# EAGLE design RS485_110V_PWM_V1 (EAGLE 6.3)
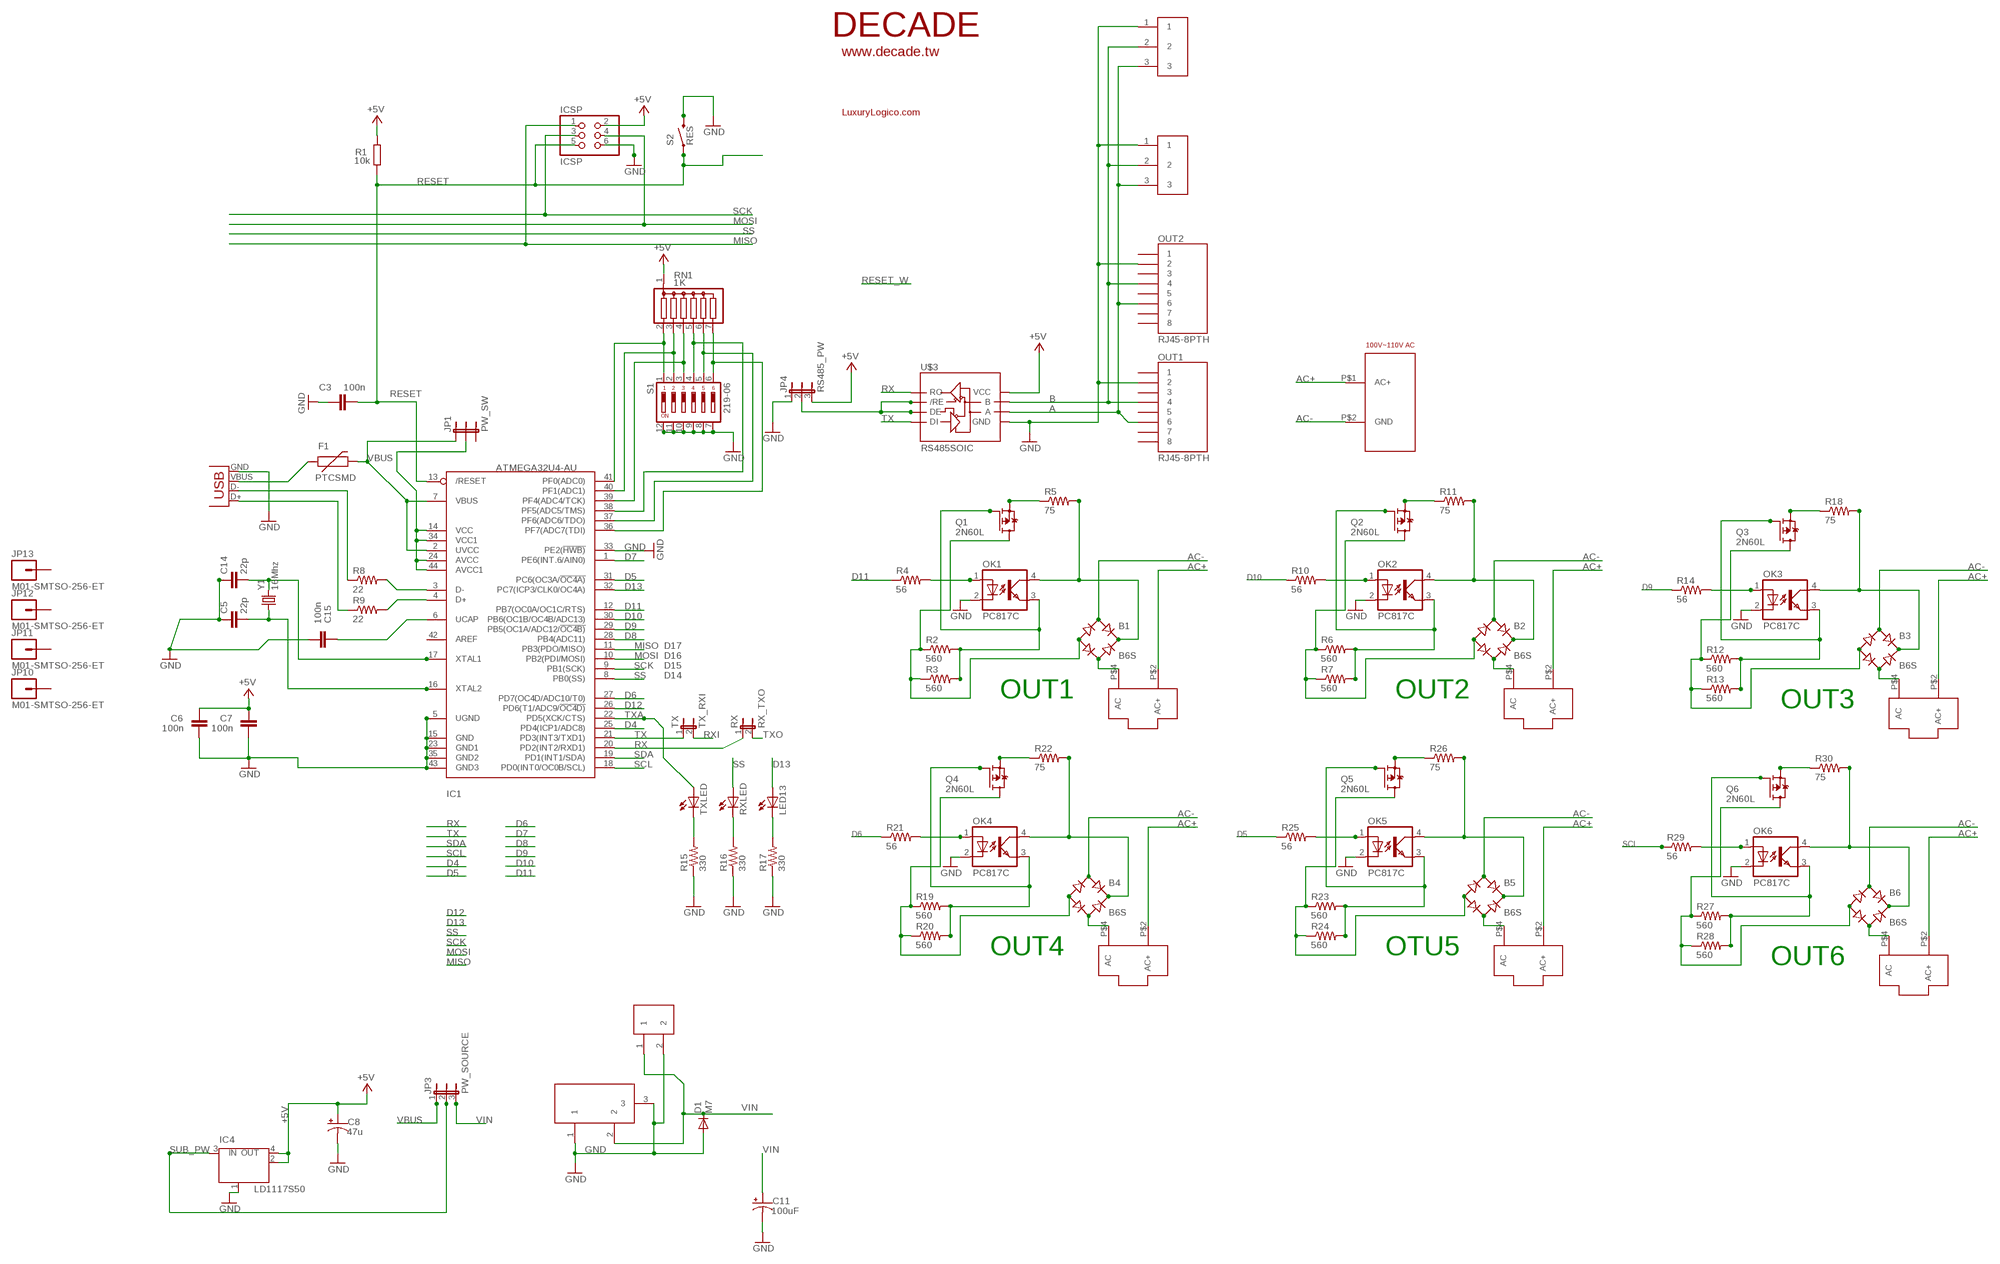
[diagram p0: schematic, sheet 1]

## Parts
B1  B6S  [MBS]
B2  B6S  [MBS]
B3  B6S  [MBS]
B4  B6S  [MBS]
B5  B6S  [MBS]
B6  B6S  [MBS]
C3  100n  C-EUC0603  [C0603-ROUND]
C5  22p  CAP0805  [0805]
C6  100n  C-EUC0603  [C0603-ROUND]
C7  100n  C-EUC0603  [C0603-ROUND]
C8  47u  CAP_POLE  [PANASONIC_E]
C11  100uF  CAP_POLE  [PANASONIC_E]
C14  22p  CAP0805  [0805]
C15  100n  C-EUC0603  [C0603-ROUND]
D1  M7  DIODE-SMB  [SMB]
F1  PTCSMD  [PTC-1206]
IC1  ATMEGA32U4-AU  [TQFP44]
IC4  LD1117S50  MC33269ST-3.3T3  [SOT223]
ICSP  ICSP  PINHD-2X3  [2X03]
JP1  PW_SW  JUMPER-3SMD  [SJ_3]
JP3  PW_SOURCE  JP2E  [JP2]
JP4  RS485_PW  JP2E  [JP2]
JP10  M01-SMTSO-256-ET  [SMTSO-256-ET]
JP11  M01-SMTSO-256-ET  [SMTSO-256-ET]
JP12  M01-SMTSO-256-ET  [SMTSO-256-ET]
JP13  M01-SMTSO-256-ET  [SMTSO-256-ET]
LED13  LEDCHIPLED_0805  [CHIPLED_0805]
OK1  PC817C  SFH618A-5X006  [DIP4-400]
OK2  PC817C  SFH618A-5X006  [DIP4-400]
OK3  PC817C  SFH618A-5X006  [DIP4-400]
OK4  PC817C  SFH618A-5X006  [DIP4-400]
OK5  PC817C  SFH618A-5X006  [DIP4-400]
OK6  PC817C  SFH618A-5X006  [DIP4-400]
OUT1  RJ45-8PTH  [RJ45-8]
OUT2  RJ45-8PTH  [RJ45-8]
Q1  2N60L  FDD4141TO252  [TO252]
Q2  2N60L  FDD4141TO252  [TO252]
Q3  2N60L  FDD4141TO252  [TO252]
Q4  2N60L  FDD4141TO252  [TO252]
Q5  2N60L  FDD4141TO252  [TO252]
Q6  2N60L  FDD4141TO252  [TO252]
R1  10k  R-EU_0603-RND  [R0603-ROUND]
R2  560  RESISTOR1206  [1206]
R3  560  RESISTOR1206  [1206]
R4  56  RESISTOR1206  [1206]
R5  75  RESISTORPTH-1W  [AXIAL-0.6]
R6  560  RESISTOR1206  [1206]
R7  560  RESISTOR1206  [1206]
R8  22  RESISTOR0805-RES  [0805]
R9  22  RESISTOR0805-RES  [0805]
R10  56  RESISTOR1206  [1206]
R11  75  RESISTORPTH-1W  [AXIAL-0.6]
R12  560  RESISTOR1206  [1206]
R13  560  RESISTOR1206  [1206]
R14  56  RESISTOR1206  [1206]
R15  330  RESISTOR0805-RES  [0805]
R16  330  RESISTOR0805-RES  [0805]
R17  330  RESISTOR0805-RES  [0805]
R18  75  RESISTORPTH-1W  [AXIAL-0.6]
R19  560  RESISTOR1206  [1206]
R20  560  RESISTOR1206  [1206]
R21  56  RESISTOR1206  [1206]
R22  75  RESISTORPTH-1W  [AXIAL-0.6]
R23  560  RESISTOR1206  [1206]
R24  560  RESISTOR1206  [1206]
R25  56  RESISTOR1206  [1206]
R26  75  RESISTORPTH-1W  [AXIAL-0.6]
R27  560  RESISTOR1206  [1206]
R28  560  RESISTOR1206  [1206]
R29  56  RESISTOR1206  [1206]
R30  75  RESISTORPTH-1W  [AXIAL-0.6]
RN1  1K  G06R  [SIL7]
RX  RX_TXO  JP1E  [JP1]
RXLED  LEDCHIPLED_0805  [CHIPLED_0805]
S1  219-06  [CTS-219-06]
S2  RES  SWITCH-MOMENTARY-2-SMD-1101NE  [TACTILE-SWITCH-1101NE]
TX  TX_RXI  JP1E  [JP1]
TXLED  LEDCHIPLED_0805  [CHIPLED_0805]
U$1  DECADE-ACIN  [DECADE-AC_IN]
U$2  DECADE-ACPW  [DECADE-ACPWR]
U$3  RS485SOIC  [SO08]
U$4  DECADE-ACPW  [DECADE-ACPWR]
U$5  DECADE-ACPW  [DECADE-ACPWR]
U$6  DECADE-ACPW  [DECADE-ACPWR]
U$7  DECADE-ACPW  [DECADE-ACPWR]
U$8  DECADE-ACPW  [DECADE-ACPWR]
U$9  DECADE-5MM-CONN  [DECADE-5MM-CON-1X2]
U$10  DECADE-5MM-CON-1X3  [DECADE-5MM-CON-1X3]
U$11  DECADE-5MM-CON-1X3  [DECADE-5MM-CON-1X3]
U$12  DECADE-LOGO-SMALL  [DECADE-LOGO-SMALL]
U$13  LL-LUXURYLOGICO.COM  [DECADE-LL-LOGO-SMALL]
X1  DC21MMX  [DC-21MM]
X3  USBOLD  [USB-MINIB-OLD]
Y1  16Mhz  CRYSTAL5X3  [CRYSTAL-SMD-5X3]

## Nets
+5V [power]: C6.1 C7.1 C8.+ IC4.2(OUT) IC4.4(OUT) ICSP.2 JP4.3 R1.2 RN1.1 U$3.8(VCC)
A: OUT1.6 OUT2.6 U$3.6(A) U$10.3 U$11.3
AC+: U$1.P$1(AC+) U$2.P$2(AC+) U$4.P$2(AC+) U$5.P$2(AC+) U$6.P$2(AC+) U$7.P$2(AC+) U$8.P$2(AC+)
AC-: B1.AC1 B2.AC1 B3.AC1 B4.AC1 B5.AC1 B6.AC1 U$1.P$2(GND)
B: OUT1.4 OUT2.4 U$3.7(B) U$10.2 U$11.2
D4: IC1.25(PD4(ICP1/ADC8))
D5: IC1.31(PC6(OC3A/!OC4A)) R25.1
D6: IC1.27(PD7(OC4D/ADC10/T0)) R21.1
D7: IC1.1(PE6(INT.6/AIN0))
D8: IC1.28(PB4(ADC11))
D9: IC1.29(PB5(OC1A/ADC12/!OC4B)) R14.1
D10: IC1.30(PB6(OC1B/OC4B/ADC13)) R10.1
D11: IC1.12(PB7(OC0A/OC1C/RTS)) R4.1
D12: IC1.26(PD6(T1/ADC9/!OC4D))
D13: IC1.32(PC7(ICP3/CLK0/OC4A)) LED13.A
GND [power]: C3.2 C5.1 C6.2 C7.2 C8.- C11.- C14.1 C15.2 D1.A IC1.5(UGND) IC1.15(GND) IC1.23(GND1) IC1.33(PE2(!HWB)) IC1.35(GND2) IC1.43(GND3) IC4.1(GND/ADJ) ICSP.6 JP4.1 OK1.2(C) OK2.2(C) OK3.2(C) OK4.2(C) OK5.2(C) OK6.2(C) OUT1.2 OUT2.2 R15.1 R16.1 R17.1 S1.7 S1.8 S1.9 S1.10 S1.11 S1.12 S2.P$2 U$3.5(GND) U$9.2 U$10.1 U$11.1 X1.1 X1.3 X3.GND
MISO: IC1.11(PB3(PDO/MISO)) ICSP.1
MOSI: IC1.10(PB2(PDI/MOSI)) ICSP.4
N$1: OK1.1(A) R4.2
N$2: Q1.2(S) R5.P$1
N$3: OK1.3(EMIT) Q1.1(G) R2.2 R3.2
N$4: OK2.1(A) R10.2
N$5: Q2.2(S) R11.P$1
N$6: C5.2 IC1.16(XTAL2) Y1.1
N$7: C14.2 IC1.17(XTAL1) Y1.3
N$8: B1.- Q1.3(D) R2.1 R3.1
N$9: OK2.3(EMIT) Q2.1(G) R6.2 R7.2
N$10: B1.AC2 U$2.P$4(AC)
N$11: IC1.3(D-) R8.2
N$12: IC1.4(D+) R9.2
N$13: R8.1 X3.D-
N$14: R9.1 X3.D+
N$15: F1.1 X3.VBUS
N$16: R15.2 TXLED.C
N$17: B2.- Q2.3(D) R6.1 R7.1
N$18: C15.1 IC1.6(UCAP)
N$19: IC1.14(VCC) IC1.24(AVCC) IC1.34(VCC1) IC1.44(AVCC1) JP1.2
N$20: B1.+ OK1.4(COL) R5.P$2
N$21: JP4.2 U$3.2(/RE) U$3.3(DE)
N$22: B2.AC2 U$4.P$4(AC)
N$23: B2.+ OK2.4(COL) R11.P$2
N$24: OK3.1(A) R14.2
N$25: Q3.2(S) R18.P$1
N$26: OK3.3(EMIT) Q3.1(G) R12.2 R13.2
N$27: B3.- Q3.3(D) R12.1 R13.1
N$28: B3.AC2 U$5.P$4(AC)
N$29: B3.+ OK3.4(COL) R18.P$2
N$30: OK4.1(A) R21.2
N$31: Q4.2(S) R22.P$1
N$32: OK4.3(EMIT) Q4.1(G) R19.2 R20.2
N$33: B4.- Q4.3(D) R19.1 R20.1
N$34: B4.AC2 U$6.P$4(AC)
N$35: B4.+ OK4.4(COL) R22.P$2
N$36: OK5.1(A) R25.2
N$37: R16.2 RXLED.C
N$38: LED13.C R17.2
N$39: Q5.2(S) R26.P$1
N$40: IC1.41(PF0(ADC0)) RN1.2 S1.1
N$41: IC1.40(PF1(ADC1)) RN1.3 S1.2
N$42: IC1.39(PF4(ADC4/TCK)) RN1.4 S1.3
N$43: IC1.38(PF5(ADC5/TMS)) RN1.5 S1.4
N$44: IC1.37(PF6(ADC6/TDO)) RN1.6 S1.5
N$45: IC1.36(PF7(ADC7(TDI)) RN1.7 S1.6
N$46: OK5.3(EMIT) Q5.1(G) R23.2 R24.2
N$47: B5.- Q5.3(D) R23.1 R24.1
N$48: B5.AC2 U$7.P$4(AC)
N$49: B5.+ OK5.4(COL) R26.P$2
N$50: OK6.1(A) R29.2
N$51: Q6.2(S) R30.P$1
N$52: OK6.3(EMIT) Q6.1(G) R27.2 R28.2
N$53: B6.- Q6.3(D) R27.1 R28.1
N$54: B6.AC2 U$8.P$4(AC)
N$55: B6.+ OK6.4(COL) R30.P$2
RESET: C3.1 IC1.13(/RESET) ICSP.5 R1.1 S2.P$1
RX: IC1.20(PD2(INT2/RXD1)) RX.1 U$3.1(RO)
RXI: TX.2
SCK: IC1.9(PB1(SCK)) ICSP.3
SCL: IC1.18(PD0(INT0/OC0B/SCL)) R29.1
SDA: IC1.19(PD1(INT1/SDA))
SS: IC1.8(PB0(SS)) RXLED.A
SUB_PW [VIN]: IC4.3(IN) JP3.2
TX: IC1.21(PD3(INT3/TXD1)) TX.1 U$3.4(DI)
TXA: IC1.22(PD5(XCK/CTS)) TXLED.A
TXO: RX.2
VBUS: F1.2 IC1.2(UVCC) IC1.7(VBUS) JP1.1 JP3.1
VIN [VIN]: C11.+ D1.C JP3.3 U$9.1 X1.2
Unconnected: IC1.42(AREF) JP1.3 JP10.P$1 JP11.P$1 JP12.P$1 JP13.P$1 OUT1.1 OUT1.3 OUT1.5 OUT1.7 OUT1.8 OUT2.1 OUT2.3 OUT2.5 OUT2.7 OUT2.8

## Notes on the sheet
- D17
- D16
- D15
- D14
- OUT1 | OUT2
- OUT3
- OUT4 | OTU5
- OUT6

## Library data of the parts
B1-B6 = rectifier:B*S: Surface Mount Glass Passivated Bridge Rectifiers Source: Comchip Bridge Rectifiers B05S-G_B10S-G.pdf
C3 C6 C7 C15 = SmartPrj:C-EU: CAPACITOR, European symbol
C5 C14 = SparkFun-Passives:CAP: Capacitor Standard 0603 ceramic capacitor, and 0.1" leaded capacitor.
C8 C11 = SparkFun-Passives:CAP_POL: Capacitor Polarized These are standard SMD and PTH capacitors. Normally 10uF, 47uF, and 100uF in electrolytic and tantalum varieties. Always verify the external diameter of the through hole cap, it varies with capacity, voltage, and manufacturer. The EIA devices should be standard.
D1 = diode:DIODE-: DIODE
F1 = SparkFun-PowerIC:PTC: Resettable Fuse PTC Resettable Fuse. Spark Fun Electronics SKU : COM-08357
IC1 = adafruit:ATMEGA32U4: http://www.ladyada.net/library/eagle
IC4 = linear:MC33269ST*: Adjustable Output Low Dropout Voltage Regulator 800 mA Source: http://www.onsemi.com/pub/Collateral/MC33269-D.PDF
ICSP = pinhead:PINHD-2X3: PIN HEADER
JP1 = SparkFun-Passives:JUMPER-3
JP3 JP4 = jumper:JP2E: JUMPER
JP10-JP13 = SparkFun-Connectors:M01: Header 1 Standard 1-pin 0.1" header. Use with straight break away headers (SKU : PRT-00116), right angle break away headers (PRT-00553), swiss pins (PRT-00743), machine pins (PRT-00117), and female headers (PRT-00115).
LED13 RXLED TXLED = led:LED: LED OSRAM: - CHIPLED LG R971, LG N971, LY N971, LG Q971, LY Q971, LO R971, LY R971 LH N974, LH R974 LS Q976, LO Q976, LY Q976 LO Q996 - Hyper CHIPLED LW Q18S LB Q993, LB Q99A, LB R99A - SideLED LS A670, LO A670, LY A670, LG A670, LP A670 LB A673, LV A673, LT A673, LW A673 LH A674 LY A675 LS A676, LA A676, LO A676, LY A676, LW A676 LS A679, LY A679, LG A679 - Hyper Micro SIDELED® LS Y876, LA Y876, LO Y876, LY Y876 LT Y87S - SmartLED LW L88C, LW L88S LB L89C, LB L89S, LG L890 LS L89K, LO L89K, LY L89K LS L896, LA L896, LO L896, LY L896 - TOPLED LS T670, LO T670, LY T670, LG T670, LP T670 LSG T670, LSP T670, LSY T670, LOP T670, LYG T670 LG T671, LOG T671, LSG T671 LB T673, LV T673, LT T673, LW T673 LH T674 LS T676, LA T676, LO T676, LY T676, LB T676, LH T676, LSB T676, LW T676 LB T67C, LV T67C, LT T67C, LS T67K, LO T67K, LY T67K, LW E67C LS E67B, LA E67B, LO E67B, LY E67B, LB E67C, LV E67C, LT E67C LW T67C LS T679, LY T679, LG T679 LS T770, LO T770, LY T770, LG T770, LP T770 LB T773, LV T773, LT T773, LW T773 LH T774 LS E675, LA E675, LY E675, LS T675 LS T776, LA T776, LO T776, LY T776, LB T776 LHGB T686 LT T68C, LB T68C - Hyper Mini TOPLED® LB M676 - Mini TOPLED Santana® LG M470 LS M47K, LO M47K, LY M47K Source: http://www.osram.convergy.de LUXEON: - LUMILED® LXK2-PW12-R00, LXK2-PW12-S00, LXK2-PW14-U00, LXK2-PW14-V00 LXK2-PM12-R00, LXK2-PM12-S00, LXK2-PM14-U00 LXK2-PE12-Q00, LXK2-PE12-R00, LXK2-PE12-S00, LXK2-PE14-T00, LXK2-PE14-U00 LXK2-PB12-K00, LXK2-PB12-L00, LXK2-PB12-M00, LXK2-PB14-N00, LXK2-PB14-P00, LXK2-PB14-Q00 LXK2-PR12-L00, LXK2-PR12-M00, LXK2-PR14-Q00, LXK2-PR14-R00 LXK2-PD12-Q00, LXK2-PD12-R00, LXK2-PD12-S00 LXK2-PH12-R00, LXK2-PH12-S00 LXK2-PL12-P00, LXK2-PL12-Q00, LXK2-PL12-R00 Source: www.luxeon.com KINGBRIGHT: KA-3528ASYC Source: www.kingbright.com
OK1-OK6 = optocoupler:SFH618?*: Optocoupler, Phototransistor Output, Low Input Current Source: Data sheet <http://www.vishay.com/docs/83673/sfh618.pdf>; OC_FARNELL: unknown; OC_NEWARK: unknown
OUT1 OUT2 = SparkFun-Connectors:RJ45-8: RJ45 Jack Simple RJ45, 8-pin connection - connector for common Cat5, Cat5e, and Cat6 Ethernet cables. Footprint not yet proven in production. Connector sku is PRT-00643; Breakout PCB sku is BOB-00716.
Q1-Q6 = transistor-fet:FDD4141: P-Channel PowerTrench® MOSFET Source: FDD4141.pdf
R1 = SmartPrj:R-EU_: RESISTOR, European symbol
R2-R7 R10-R14 R18-R30 = SparkFun-Resistors:RESISTOR: Resistor Basic schematic elements and footprints for 0603, 1206, and PTH resistors.
R8 R9 R15-R17 = SparkFun-Passives:RESISTOR: Resistor Basic schematic elements and footprints for 0603, 1206, and PTH resistors.
RN1 = resistor-sil:G06R: SIL RESISTOR; OC_FARNELL: unknown; OC_NEWARK: unknown
RX TX = jumper:JP1E: JUMPER
S1 = switch-dil:219-06*: Surface Mount DIP Switch Series 219 SMT CTS Electronic Components Sourc: www.ctscorp.com; OC_FARNELL: unknown; OC_NEWARK: unknown
S2 = SparkFun-Electromechanical:SWITCH-MOMENTARY-2: Various NO switches- pushbuttons, reed, etc
U$1 = DECADE-libraries:DECADE-ACIN
U$2 U$4-U$8 = DECADE-libraries:DECADE-ACPW
U$3 = SparkFun-DigitalIC:RS485: RS485 transceiver
U$9 = DECADE-libraries:DECADE-5MM-CONN
U$10 U$11 = DECADE-libraries:DECADE-5MM-CON-1X3
U$12 = DECADE-libraries:DECADE-LOGO-SMALL
U$13 = DECADE-libraries:LL-LUXURYLOGICO.COM
X1 = powersupply:DC21MM
X3 = SparkFun-Connectors:USB: USB Connectors USB-B-PTH is fully proven SKU : PRT-00139 USB-miniB is fully proven SKU : PRT-00587 USB-A-PCB is untested. USB-A-H is throughly reviewed, but untested. Spark Fun Electronics SKU : PRT-00437 USB-B-SMT is throughly reviewed, but untested. Needs silkscreen touching up. USB-A-S has not been used/tested USB-MB-H has not been used/tested
Y1 = SparkFun-FreqCtrl:CRYSTAL: Various standard crystals. Proven footprints. Spark Fun Electronics SKU : COM-00534

## Net classes
0 default: width 0.152 mm, drill 0.152 mm, clearance 0.152 mm
1 power: width 0.152 mm, drill 0.152 mm, clearance 0.152 mm
2 VIN: width 0.61 mm, drill 0.152 mm, clearance 0.305 mm

## Board
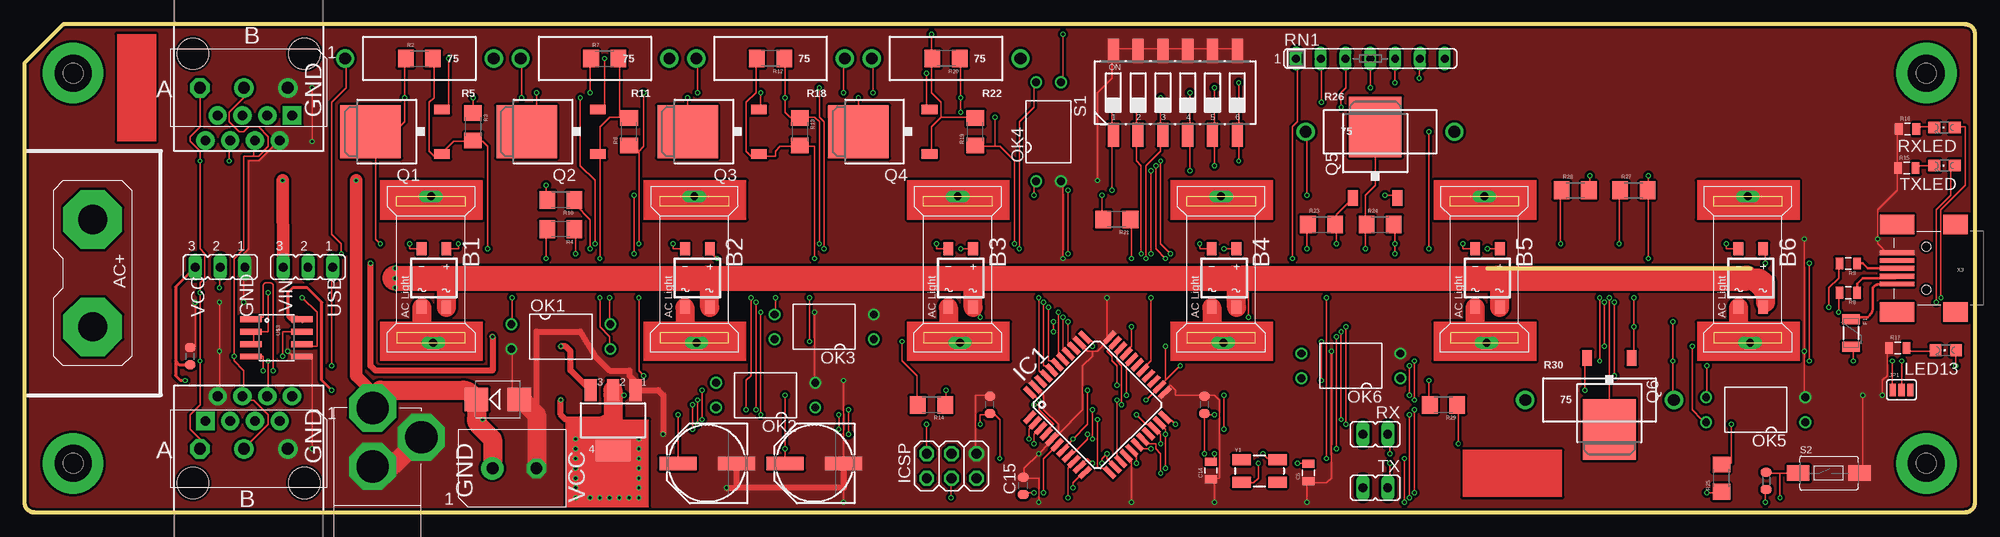
[diagram p1: board, top side]
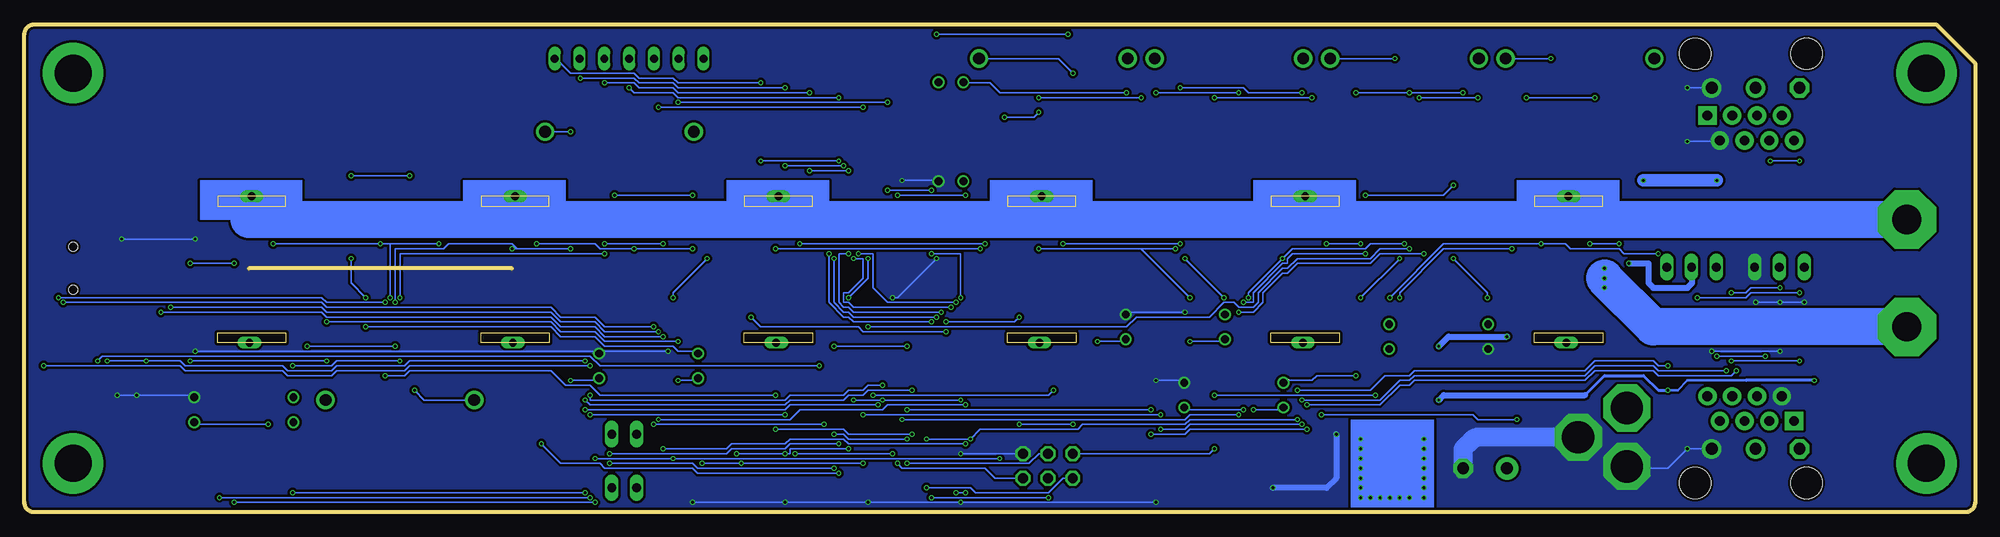
[diagram p2: board, bottom side, seen from below]

Size 200 x 50 mm. Coordinates in mm from the lower left corner, seen from the top.
Outline: 0,46 0,1 arc90 1,0 199,0 arc90 200,1 200,49 arc90 199,50 4,50 0,46
Copper layers (1*16): Top 0.035mm / dielectric 1.5mm / Bottom 0.035mm
Design rules "Fast_ChinaPCB-2012-6mil-off-MASK": minimum track width 6mil, minimum drill 0.3mm, track to track 6mil, track to pad 6mil, pad to pad 6mil, via to via 6mil, smd to smd 6mil, copper to edge 10mil, drill to drill 15mil, minimum pad ring 8mil, minimum via ring 4mil, stop-mask expansion 2mil, vias tented up to drill 13mil, thermal gap 10mil
Milling: 1 lines

### Footprints (pad centres in the part's own frame; a part is rotated, then mirrored left to right if it is on the bottom)
MBS = smd 1 x 1.3: + -1.27,-3; - 1.27,-3; AC1 -1.27,3; AC2 1.27,3
C0603-ROUND = smd 0.898 x 1.1: 1 -0.889,0; 2 0.889,0
0805 = smd 0.8 x 1.2: 1 -0.9,0; 2 0.9,0
PANASONIC_E = smd 3.8 x 1.4: + 3,0; - -3,0
SMB = smd 2.4 x 2.4: A 2.2,0; C -2.2,0
PTC-1206 = smd 1 x 1.8: 1 -1.4,0; 2 1.4,0
TQFP44 = smd 1.5 x 0.5: 1 -5.8,4; 2 -5.8,3.2; 3 -5.8,2.4; 4 -5.8,1.6; 5 -5.8,0.8; 6 -5.8,0; 7 -5.8,-0.8; 8 -5.8,-1.6; 9 -5.8,-2.4; 10 -5.8,-3.2; 11 -5.8,-4; 23 5.8,-4; 24 5.8,-3.2; 25 5.8,-2.4; 26 5.8,-1.6; 27 5.8,-0.8; 28 5.8,0; 29 5.8,0.8; 30 5.8,1.6; 31 5.8,2.4; 32 5.8,3.2; 33 5.8,4 | smd 0.5 x 1.5: 12 -4,-5.8; 13 -3.2,-5.8; 14 -2.4,-5.8; 15 -1.6,-5.8; 16 -0.8,-5.8; 17 0,-5.8; 18 0.8,-5.8; 19 1.6,-5.8; 20 2.4,-5.8; 21 3.2,-5.8; 22 4,-5.8; 34 4,5.8; 35 3.2,5.8; 36 2.4,5.8; 37 1.6,5.8; 38 0.8,5.8; 39 0,5.8; 40 -0.8,5.8; 41 -1.6,5.8; 42 -2.4,5.8; 43 -3.2,5.8; 44 -4,5.8
SOT223 = smd 1.219 x 2.235: 1 -2.311,-3.099; 2 0,-3.099; 3 2.311,-3.099 | smd 3.6 x 2.2: 4 0,3.099
2X03 = drill 1.016 octagon: 1 -2.54,-1.27; 2 -2.54,1.27; 3 0,-1.27; 4 0,1.27; 5 2.54,-1.27; 6 2.54,1.27
SJ_3 = smd 0.635 x 1.27: 1 -0.889,0; 2 0,0; 3 0.889,0
JP2 = drill 0.914 long: 1 -2.54,0; 2 0,0; 3 2.54,0
SMTSO-256-ET = drill 3.81 pad 6.198: P$1 0,0
CHIPLED_0805 = smd 1.2 x 1.2: A 0,-1.05; C 0,1.05
DIP4-400 = drill 0.8: 1 -1.27,-5.08; 2 1.27,-5.08; 3 1.27,5.08; 4 -1.27,5.08
RJ45-8 = drill 1 pad 1.88 square: 1 -4.445,6.35 | drill 1 pad 1.88: 2 -3.175,8.89; 3 -1.905,6.35; 4 -0.635,8.89; 5 0.635,6.35; 6 1.905,8.89; 7 3.175,6.35; 8 4.445,8.89 | hole 3.2: -5.715,0; 5.715,0
TO252 = smd 1 x 1.6: 1 -2.28,-4.8; 2 2.28,-4.8 | smd 5.4 x 6.2: 3 0,2.5
R0603-ROUND = smd 0.898 x 1.1: 1 -0.889,0; 2 0.889,0
1206 = smd 1.6 x 1.8: 1 -1.4,0; 2 1.4,0
AXIAL-0.6 = drill 1.2 pad 1.88: P$1 -7.62,0; P$2 7.62,0
SIL7 = drill 0.813 long: 1 -7.62,0; 2 -5.08,0; 3 -2.54,0; 4 0,0; 5 2.54,0; 6 5.08,0; 7 7.62,0
JP1 = drill 0.914 long: 1 0,-1.27; 2 0,1.27
CTS-219-06 = smd 1.13 x 2.44: 1 -6.35,-4.3; 2 -3.81,-4.3; 3 -1.27,-4.3; 4 1.27,-4.3; 5 3.81,-4.3; 6 6.35,-4.3; 7 6.35,4.3; 8 3.81,4.3; 9 1.27,4.3; 10 -1.27,4.3; 11 -3.81,4.3; 12 -6.35,4.3
TACTILE-SWITCH-1101NE = smd 2.3 x 1.6: P$1 -3.15,0; P$2 3.15,0
DECADE-AC_IN = drill 3 pad 6 octagon: P$1 0,5; P$2 0,-6
DECADE-ACPWR = drill 0.8 long: P$2 -0.31,7.38; P$4 -0.08,-7.62
SO08 = smd 0.61 x 2.21: 1 -1.905,-2.616; 2 -0.635,-2.616; 3 0.635,-2.616; 4 1.905,-2.616; 5 1.905,2.616; 6 0.635,2.616; 7 -0.635,2.616; 8 -1.905,2.616
DECADE-5MM-CON-1X2 = drill 1.2 pad 2.3: 1 4.5,0 | drill 1.2 pad 2 octagon: 2 0,0
DECADE-5MM-CON-1X3 = drill 1.2 pad 2: 1 9,0; 2 4.5,0 | drill 1.2 pad 2 octagon: 3 0,0
DC-21MM = drill 3.302 pad 4.826 octagon: 1 -5.08,-3.353; 2 -0.076,-6.35; 3 -0.076,-0.356
USB-MINIB-OLD = smd 2.5 x 2: 1 -3,-4.5; 2 -3,4.5 | smd 3.5 x 2: 3 3,-4.5; 4 3,4.5 | smd 3.5 x 0.5: D+ 3,0; D- 3,0.8; GND 3,-1.6; ID 3,-0.8; VBUS 3.01,1.61 | hole 0.9: 0,2.2; 0,-2.2
CRYSTAL-SMD-5X3 = smd 1.9 x 1.1: 1 -1.85,-1.15; 2 1.85,-1.15; 3 1.85,1.15; 4 -1.85,1.15

### Placement (x,y rotation side)
B1  42,24 180 top
B2  69,24 180 top
B3  96,24 180 top
B4  123,24 180 top
B5  150,24 180 top
B6  177,24 180 top
C3  121,11 90 top
C5  131.65,4.06 90 top
C6  17,16 90 top
C7  99,11 90 top
C8  81,5 180 top
C11  70,5 180 top
C14  121.65,4.27 90 top
C15  102.41,2.7 90 top
D1  48.55,11.57 0 top
E$1  [DECADE-LL-LOGO-SMALL]  9.5,49 270 top
F1  187.28,18.37 270 top
IC1  110,11 45 top
IC4  MC33269ST-5  [SOT223]  60.35,9.41 180 top
ICSP  95.06,4.74 0 top
JP1  192.46,12.54 0 top
JP3  29.07,25.13 180 top
JP4  20.07,25.13 180 top
JP10  195,5 0 top
JP11  5,5 0 top
JP12  195,45 0 top
JP13  5,45 0 top
LED13  196.99,16.59 90 top
OK1  55,18 270 top
OK2  76,12 90 top
OK3  82,19 90 top
OK4  105,39 0 top
OK5  177.5,10.5 90 top
OK6  136,15 90 top
OUT1  23,47 180 top
OUT2  23,3 0 top
Q1  38,39 90 top
Q2  54,39 90 top
Q3  70.5,39 90 top
Q4  88,39 90 top
Q5  138.5,37 0 top
Q6  162.5,11 180 top
R1  178.57,3.22 270 top
R2  40.5,46.5 0 top
R3  46,39.5 270 top
R4  55,29 180 top
R5  40.5,46.5 180 top
R6  62,39 90 top
R7  59.5,46.5 0 top
R8  187,22.5 180 top
R9  187,25.5 180 top
R10  55,32 180 top
R11  58.5,46.5 180 top
R12  76.5,46.5 180 top
R13  79.5,39 270 top
R14  93,11 180 top
R15  192.99,35.27 0 top
R16  193.07,39.27 0 top
R17  192.07,16.84 0 top
R18  76.5,46.5 180 top
R19  97.5,39 90 top
R20  94.5,46.5 180 top
R21  112,30 180 top
R22  94.5,46.5 180 top
R23  133,29.5 0 top
R24  139,29.5 0 top
R25  174,3.5 90 top
R26  139,39 0 top
R27  165,33 0 top
R28  159,33 0 top
R29  145.5,11 180 top
R30  161.5,11.5 0 top
RN1  138,46.5 0 top
RX  138.5,8 90 top
RXLED  196.86,39.43 90 top
S1  118,43 0 top
S2  185,4 0 top
TX  138.5,2.5 90 top
TXLED  196.86,35.53 90 top
U$1  7,25 0 top
U$2  42,25 0 top
U$3  25.86,17.86 270 top
U$4  69,25 0 top
U$5  96,25 0 top
U$6  123,25 0 top
U$7  150,25 0 top
U$8  177,25 0 top
U$9  52.5,4.5 180 top
U$10  18,43.5 0 top
U$11  18,6.5 0 top
U$12  147.5,1.5 0 top
X1  35.62,4.33 180 top
X3  195,25 180 top
Y1  126.63,4.22 0 top

### Tracks (layer width: path | path; a pad name or v marks a point on that pad's centre or on a via)
+5V  (via drill 0.3)
  Top 0.152: v98,9 98,10 99,10 C7.1 99,10.5 100,9.5 v100,5.5 | v92.5,9 92.5,6.5 ICSP.2 | v178.5,1 178.5,2 R1.2 | v141.5,5.5 v141.5,1 | v130,26 130,39.5 130.5,40 130.5,46.5 RN1.1 | v133.5,5.5 v133.5,22 | C8.+ v78,6.5 v78,12 | v61.5,12 60.35,12
  Top 0.305: v31.5,12.5 30.5,13.5 30.5,21.5 29,23 27.5,23 27,22.5 27,20 | 27,20 27.5,19.5 27.77,19.77 U$3.8 28.5,19.74 28.5,19.5 28,20 27,20 | 15.5,15.5 15.5,23.1 JP4.3 | 15.5,15.5 15.89,15.11 C6.1 | 15.5,15.5 15.5,14 16,13.5 v16.5,13.5
  Top 0.61: IC4.2 60,10 59,9.5 55.5,9.5 55,10 v55,11.5
  Top 1.93: IC4.2 60.35,12 IC4.4
  Bottom 0.152: v92.5,9 v98,9 | v141.5,1 v178.5,1 | v100,5.5 v133.5,5.5 v141.5,5.5 | v130,26 133.5,22.5 v133.5,22 | v78,6.5 78.5,6 92.5,6 ICSP.2 | v78,12 v61.5,12
  Bottom 0.254: 23.5,13.5 29.5,13.5 30.5,12.5 v31.5,12.5
  Bottom 0.305: 40,12 38,14 34,14 32.5,12.5 v31.5,12.5 | v16.5,13.5 23.5,13.5
  Bottom 0.61: v55,11.5 54.5,12 40,12
A  (via drill 0.3)
  Top 0.152: U$10.3 18,39.5 17,38.5 17,38 18,37 v18,36 18,27 18.5,26.5 18.5,24 18,23.5 v18,22.5 v18,15.5 18,11 17,10 17,8.5 18,7.5 U$11.3 | v28.5,22 30,20.5 30,17 28.5,17 U$3.6 | v25,15.5 25,12 OUT2.6 | v21,36 21,38 OUT1.6
  Bottom 0.152: v28.5,22 23.5,22 23,22.5 v18,22.5 | v18,15.5 v25,15.5 | v18,36 v21,36
AC+
  Bottom 1.016: U$2.P$2 42,32.38 42,30 | U$4.P$2 69,32.38 69,30 | U$5.P$2 95.5,32.38 95.5,30 | U$6.P$2 122.5,32.38 122.5,30 | U$7.P$2 150,32.38 150,30 | U$8.P$2 177,32.38 177,32
  Bottom 3.81: U$1.P$1 42,30 69,30 95.5,30 122.5,30 150,30 177,30 177,32
AC-  (via drill 0.3)
  Top 0.152: B6.AC1 178.5,21 178.5,21.5 | v125.5,20 125.5,22.5 125,23 125,24 | v105.5,19.5 v105.5,18.5 | v98,20 98,20.5 B3.AC1
  Top 1.93: B1.AC1 43.27,23.35 arc45 43,24 | B2.AC1 70.27,23.35 arc45 70,24 | B4.AC1 124.27,23.35 arc45 124,24 | B3.AC1 97.27,22.85 arc45 97,23.5 | B5.AC1 151.27,23.35 arc45 151,24 | 176.59,24 177.59,24 arc-45 178.29,23.71 178.5,23.5 178.5,22.5 | 178.5,22.5 178.5,21.5 | 177.5,23.5 178.5,22.5
  Top 2.54: v38,24 43,24 70,24 124,24 125,24 151,24 176.59,24
  Bottom 0.152: v125.5,20 124.5,19 114.5,19 114,18.5 v105.5,18.5 | v105.5,19.5 98.5,19.5 v98,20
  Bottom 3.81: U$1.P$2 33,19 v38,24
B  (via drill 0.3)
  Top 0.152: U$11.2 22.5,7 23,7 25,9 25,10 23.5,11.5 22.5,11.5 OUT2.4 22.5,12 22.5,14.5 21.5,15.5 v21.5,16 21.5,26 22.5,27 22.5,36.5 23.5,36.5 | U$10.2 22.5,42.5 21,41 21,40 22,39 22.5,39 23,39.5 24,39.5 25,38.5 25,37.5 24,36.5 23.5,36.5 | v26.5,16 26.5,18.5 28,18.5 U$3.7 | 23.5,36.5 23.5,38 OUT1.4
  Bottom 0.152: v21.5,16 v26.5,16
D5  (via drill 0.3)
  Top 0.152: v112.5,11 112.5,15 112,15.5 112,16.5 IC1.31 | v142.5,2 v142.5,10.5 | v172.5,2 174,2 R25.1
  Bottom 0.152: v112.5,11 121.5,11 122,10.5 v142.5,10.5 | v172.5,2 v142.5,2
D6  (via drill 0.3)
  Top 0.152: v115.5,22 115.5,15.5 115,15 IC1.27 | v113.5,26 113.5,30 R21.1
  Bottom 0.152: v115.5,22 113.5,24 v113.5,26
D9  (via drill 0.3)
  Top 0.152: v113,12 113,15 113.5,15.5 IC1.29 | v94.5,12.5 94.5,11 R14.1
  Bottom 0.152: v113,12 95,12 v94.5,12.5
D10  (via drill 0.3)
  Top 0.152: v113.5,19 113.5,17 113,16.5 IC1.30 | v58,27 58,30 56.5,31.5 56.5,32 R10.1
  Bottom 0.152: v113.5,19 87,19 86,20 78.5,20 77,21.5 76,21.5 75.5,21 74,21 73.5,21.5 73.5,22.5 71,25 70.5,25 69.5,26 62,26 61,27 v58,27
D11  (via drill 0.3)
  Top 0.152: v110,9.5 110,4.5 111,4.5 IC1.12 | v75.5,20.5 v75.5,10 | v56.5,26.5 56.5,29 R4.1
  Bottom 0.152: v110,9.5 81,9.5 80.5,10 v75.5,10 | v75.5,20.5 74,20.5 73,21.5 73,22.5 71,24.5 70.5,24.5 69.5,25.5 62,25.5 61,26.5 v56.5,26.5
D13  (via drill 0.3)
  Top 0.152: v198,15 198,16.5 LED13.A | v142,12 v142,15 | v112,13 112,15 111.5,15.5 111.5,16 111,16.5 111.5,17 IC1.32
  Bottom 0.152: v198,15 184,15 183.5,14.5 173.5,14.5 173,14 168.5,14 168,14.5 161,14.5 160.5,15 v142,15 | v142,12 142,11.5 122,11.5 121.5,12 116,12 115.5,12.5 114,12.5 113.5,13 v112,13
GND  (via drill 0.3)
  Top 0.152: v29.5,43.5 v29.5,38 | v17.5,21.5 17.5,17 17,17 C6.2 | v22.5,21.5 22.5,25 JP4.1 22.5,25.5 22.5,26.5 23,27 23,36 24,36 26,38 OUT1.2 | v20,21.5 v20,16.5 20,12 OUT2.2 | v29.5,6.5 29.5,16 28.5,16 U$3.5 28,16 27.5,16 v27,16.5 | OK1.2 50,16.5 50,12 D1.A | R16.1 192,39 192,35.5 R15.1 192,35 192,33 190,31 v190,28 190,27.5 191,26.5 192,26.5 X3.GND | v190.5,12 190.5,13.5 191,14 191,16.5 R17.1 | v188.5,12 188.5,4 S2.P$2 | v182.5,28 v182.5,16.5 182.5,12 OK5.2 | S1.7 124,47.5 122,47.5 S1.8 121.5,47.5 119.5,47.5 S1.9 119,47.5 117,47.5 S1.10 116.5,47.5 114.5,47.5 S1.11 114,47.5 112,47.5 S1.12 111.5,47 111.5,44.5 110,43 v110,34 | v81,20.5 81,13.5 OK2.2 | v84,13.5 C8.- | C7.2 99,12 97.5,12 97.5,6.5 ICSP.6 | 109.5,16.5 110,16.5 111,17.5 IC1.33 111,18 v111,22 | 109.5,16.5 109,16.5 108.5,17 IC1.35 | 106,8 106,9 104.5,10.5 104.5,12 104,12.5 IC1.43 | 106,8 105.5,7.5 IC1.5 105,7 v104,6 102.5,4.5 102.5,4 C15.2 102.5,3.5 104,3.5 v104,1 | 109.5,16.5 109.5,16 108.5,15 108.5,10.5 106,8 | 121,12 118,12 118,12.5 117.5,13 117,12.5 IC1.23 | 121,12 122,12 122.5,11.5 122.5,3.5 122,3.5 C14.1 122,3 v122,1 | 121,12 C3.2 | v131.5,1 131.5,3 C5.1 132,3 133.5,3 134,3.5 v134,16.5 | v113.5,1 113.5,5.5 113,5.5 IC1.15 | v84,1 84,2.5 | v106.5,26 106.5,33.5 OK4.2
  Top 0.61: 52.5,10 52.5,18.5 57,18.5 58.5,16 60,14.5 62,14.5 62,14 62.5,13.5 62.5,12.67 IC4.1 64.99,12.51 65.5,12 v65.5,8 | v72,2.5 73,2.5 | 73,2.5 C11.- | C8.- 84,2.5 73,2.5
  Top 1.93: X1.3 37.29,4.69 arc45 37.99,4.98 X1.1 | D1.A arc-45 51.06,11.44 52.5,10 U$9.2
  Bottom 0.152: v29.5,38 26.5,38 OUT1.2 | U$10.1 v29.5,43.5 | v22.5,21.5 v20,21.5 v17.5,21.5 | U$11.1 v29.5,6.5 31.5,4.5 35.5,4.5 X1.3 | v27,16.5 v20,16.5 | v190.5,12 v188.5,12 183,12 OK5.2 | v182.5,28 v190,28 | v110,34 106.5,34 OK4.2 | v81,20.5 87,20.5 OK3.2 | v84,13.5 81.5,13.5 OK2.2 | v104,6 98,6 ICSP.6 | v131.5,1 v122,1 v113.5,1 v104,1 v84,1 | v134,16.5 141,16.5 OK6.2 141.5,16.5 v182.5,16.5 | v106.5,26 110.5,22 v111,22
  Bottom 0.61: v65.5,8 65.5,3.5 66.5,2.5 v72,2.5
  Bottom 1.93: X1.1 50.9,7.69 arc-45 51.61,7.39 52.5,6.5 U$9.2
  pour Top (isolate 0.254, no thermals): 0,1 0,0.5 0.5,0 199,0 200,1 200,49 199,50 4,50 0,46
  pour Bottom (isolate 0.254, no thermals): 4,50 0,46 0,1 1,0 199,0 200,1 200,49 199,50
MISO  (via drill 0.3)
  Top 0.152: v107.5,2.5 107.5,3 108.5,4 IC1.11
  Bottom 0.152: v107.5,2.5 103,2.5 102.5,2 95,2 93.5,3.5 93,3.5 ICSP.1
MOSI  (via drill 0.3)
  Top 0.152: v109.5,5 109,5.5 108.5,5 IC1.10
  Bottom 0.152: v109.5,5 97,5 96,6 95.5,6 ICSP.4
N$1  (via drill 0.3)
  Top 0.152: v53.5,26 53.5,29 R4.2 | v50,22 50,19.5 OK1.1
  Bottom 0.152: v53.5,26 50,22.5 v50,22
N$2  (via drill 0.3)
  Top 0.152: v43.5,46.5 43.5,41.5 43,41.5 Q1.2
  Bottom 0.152: R5.P$1 v43.5,46.5
N$3  (via drill 0.3)
  Top 0.152: 46,38 44,38 43,37 Q1.1 42.5,36.5 42,36.5 41.5,37 41.5,42 42,42.5 42,46.5 R2.2 | v59,22 59,19 60,18 60,17 OK1.3 | v47.5,27 47.5,37.5 47,38 46,38 | 46,38 R3.2
  Bottom 0.152: v59,22 59,22.5 54.5,27 v47.5,27
N$4  (via drill 0.3)
  Top 0.152: v53.5,33.5 53.5,32 R10.2 | v62.5,26.5 v62.5,32.5 | v75,10.5 v75,21.5
  Bottom 0.152: v53.5,33.5 54.5,32.5 v62.5,32.5 | v62.5,26.5 70,26.5 70.5,26 70.5,25.5 71,25.5 74,22.5 74,21.5 v75,21.5 | v75,10.5 81,10.5 OK2.1
N$5  (via drill 0.3)
  Top 0.152: v59.5,46.5 59.5,41.5 59,41.5 Q2.2
  Bottom 0.152: R11.P$1 v59.5,46.5
N$6  (via drill 0.3)
  Top 0.152: v130.5,5 131.5,5 C5.2 | v126.5,5 126.5,3.5 126,3 125,3 Y1.1 | v114,5 114,6 IC1.16
  Bottom 0.152: v130.5,5 v126.5,5 v114,5
N$7  (via drill 0.3)
  Top 0.152: v122,6 122,5.5 C14.2 | v127,6 128,5 Y1.3 | v115.5,6.5 114.5,6.5 IC1.17
  Bottom 0.152: v127,6 v122,6 121.5,6 121.5,6.5 v115.5,6.5
N$8  (via drill 0.3)
  Top 0.152: B1.- 39.5,27 v39.5,27.5 | v36.5,27.5 36,28 36,39 | 36,39 38,39 39,40 v39,42.5 39,46.5 R2.1 | 36,39 Q1.3 | v46,42.5 R3.1
  Bottom 0.152: v36.5,27.5 v39.5,27.5 | v39,42.5 v46,42.5
N$9  (via drill 0.3)
  Top 0.152: 61,40.5 62,40.5 R6.2 | 61,40.5 60,40.5 59,39.5 59,37 Q2.1 59,36.5 v59,26 | 61,40.5 61,46.5 R7.2 | v63.5,14 63,14.5 v63,22
  Bottom 0.152: v63.5,14 67.5,14 68,13.5 70.5,13.5 OK2.3 | v59,26 v63,22
N$10
  Top 1.93: B1.AC2 40.73,18.98 arc45 41.02,18.28 U$2.P$4
N$11  (via drill 0.3)
  Top 0.152: v186,20.5 186,22.5 R8.2 | v134.5,6.5 v134.5,18 | v103.5,7 103.5,8 104,8.5 IC1.3
  Bottom 0.152: v186,20.5 169.5,20.5 169,20 146,20 145,19 141.5,19 140.5,18 v134.5,18 | v134.5,6.5 128,6.5 127.5,7 122,7 121.5,7.5 116,7.5 115.5,7 v103.5,7
N$12  (via drill 0.3)
  Top 0.152: v185,21 185,23 186,24 186,25.5 R9.2 | v135,9.5 v135,18.5 | v103.5,11 104,11 104,10.5 105.5,9 105,8.5 IC1.4
  Bottom 0.152: v185,21 169.5,21 169,20.5 146,20.5 145,19.5 141.5,19.5 140.5,18.5 v135,18.5 | v135,9.5 121.5,9.5 120.5,10.5 112,10.5 111.5,11 v103.5,11
N$13
  Top 0.254: R8.1 187.9,23.4 188.5,24 191.8,24 X3.D-
N$14
  Top 0.254: R9.1 188.5,25.5 189,25 X3.D+
N$15
  Top 0.254: X3.VBUS 190.3,23.39 arc45 189.6,23.1 189.5,23 189.5,20.91 arc-45 189.21,20.21 189,20 187.83,20 arc45 F1.1
N$16
  Top 0.152: R15.2 194,35.5 195.5,35.5 TXLED.C
N$17  (via drill 0.3)
  Top 0.152: B2.- 66.5,27 v66.5,27.5 | 63,37 v63,27.5 | 63,37 62,38 R6.1 | v58,43 58,46.5 R7.1 | v52.5,43 52.5,39.5 52,39 Q2.3 | 63,37 63.5,37.5 v63.5,43
  Bottom 0.152: v63,27.5 v66.5,27.5 | v52.5,43 v58,43 v63.5,43
N$18  (via drill 0.3)
  Top 0.152: v103.5,2 102.5,2 C15.1 | v104.5,2 104.5,5.5 IC1.6
  Bottom 0.152: v104.5,2 v103.5,2
N$19  (via drill 0.3)
  Top 0.152: v192.5,15.5 192.5,13 JP1.2 | 117,13.5 116.5,13 IC1.24 116,12.5 v115,11.5 | 117,13.5 v118.5,15 | v104,11.5 103.5,12 IC1.44 | v112,11.5 112,5.5 IC1.14 | v109.5,17 109.5,17.5 109,17.5 IC1.34 | 117,13.5 v117,17
  Bottom 0.152: v192.5,15.5 192,16 142,16 141,15 v118.5,15 | v115,11.5 v112,11.5 v104,11.5 | v117,17 v109.5,17
N$20  (via drill 0.3)
  Top 0.152: B1.+ 44.5,27 v44.5,27.5 | v60,22 60,19.5 OK1.4 | v32.5,26.5 32.5,27.5 31.5,28.5 31.5,42 33,43.5 33,46.5 R5.P$2
  Bottom 0.152: v60,22 54.5,27.5 v44.5,27.5 42,27.5 41.5,27 36.5,27 36,26.5 v32.5,26.5
N$21  (via drill 0.3)
  Top 0.152: 23.5,18.5 23.5,17.5 U$3.3 | 23.5,18.5 25,18.5 v25,22.5 | v20,23 20,25 JP4.2 | 23.5,18.5 U$3.2
  Bottom 0.152: v25,22.5 23.5,22.5 23,23 v20,23
N$22
  Top 1.93: B2.AC2 67.73,18.98 arc45 68.02,18.28 U$4.P$4
N$23  (via drill 0.3)
  Top 0.152: v71,26 70.5,26.5 70.5,27 B2.+ | v74.5,22 74.5,14 74,13.5 v74,10.5 | v51,42.5 51,46.5 R11.P$2 | v57,42.5 57,35.5 58.5,34 v58.5,27.5
  Bottom 0.152: v74.5,22 74.5,22.5 v71,26 70,27 62.5,27 62,27.5 v58.5,27.5 | v74,10.5 71,10.5 OK2.4 | v57,42.5 v51,42.5
N$24  (via drill 0.3)
  Top 0.152: v90,17.5 90,15.5 91.5,14 91.5,11 R14.2
  Bottom 0.152: v90,17.5 87.5,17.5 OK3.1
N$25  (via drill 0.3)
  Top 0.152: v75.5,43 75.5,41.5 Q3.2 | v84,43 84,46.5 R18.P$1
  Bottom 0.152: v84,43 v75.5,43
N$26  (via drill 0.3)
  Top 0.152: 79.5,37.5 77.5,37.5 77,37 77,36.5 75.5,36.5 Q3.1 75,36.5 74.5,36.5 74,37 74,42 75,43 75,46.5 R12.2 | v77,22 77,20.5 OK3.3 | v81,26 81,37.5 79.5,37.5 | 79.5,37.5 R13.2
  Bottom 0.152: v81,26 v77,22
N$27  (via drill 0.3)
  Top 0.152: B3.- 93.5,27 v93.5,27.5 | v81.5,27.5 81.5,40 81,40.5 79.5,40.5 | 79.5,40.5 78.5,40.5 78,41 v78,42.5 78,46.5 R12.1 | 79.5,40.5 R13.1 | v68,42.5 Q3.3
  Bottom 0.152: v81.5,27.5 v93.5,27.5 | v78,42.5 v68,42.5
N$28
  Top 1.93: B3.AC2 94.73,18.98 arc45 95.02,18.28 U$5.P$4
N$29  (via drill 0.3)
  Top 0.152: v96,27 B3.+ | v80.5,17.5 v80.5,22 | v69,43 69,46.5 R18.P$2 | v81.5,43.5 81.5,40.5 82,40 v82,27
  Bottom 0.152: 85.5,27 v96,27 | v80.5,22 85.5,27 | v80.5,17.5 77,17.5 OK3.4 | v69,43 74.5,43 75,43.5 v81.5,43.5 | 85.5,27 v82,27
N$30  (via drill 0.3)
  Top 0.152: v110.5,32.5 110.5,30 R21.2 | v103.5,32.5 103.5,33.5 OK4.1
  Bottom 0.152: v103.5,32.5 v110.5,32.5
N$31  (via drill 0.3)
  Top 0.152: v92.5,45 92.5,41.5 Q4.2
  Bottom 0.152: v92.5,45 94,46.5 R22.P$1
N$32  (via drill 0.3)
  Top 0.152: 93,46.5 93,43 94,42 94,40.5 | 94,40.5 93,39.5 93,37 Q4.1 | 94,40.5 97.5,40.5 R19.2 | v106.5,49 106.5,44.5 OK4.3 | 93,46.5 v93,49 | 93,46.5 R20.2
  Bottom 0.152: v93,49 v106.5,49
N$33  (via drill 0.3)
  Top 0.152: B4.- 120.5,27 v120.5,27.5 | v101.5,27.5 101.5,36 100,37.5 99.5,37.5 | 99.5,37.5 97.5,37.5 R19.1 | v96,41 v96,42.5 96,46.5 R20.1 | 99.5,37.5 v99.5,40.5 | v85.5,42.5 Q4.3
  Bottom 0.152: v101.5,27.5 v120.5,27.5 | v96,41 96.5,40.5 v99.5,40.5 | v96,42.5 v85.5,42.5
N$34
  Top 1.93: B4.AC2 121.73,18.98 arc45 122.02,18.28 U$6.P$4
N$35  (via drill 0.3)
  Top 0.152: v123,27 B4.+ | v102,27 102,40 103.5,41.5 103.5,44 OK4.4 | v87,43 87,46.5 R22.P$2
  Bottom 0.152: v102,27 v123,27 | v87,43 100,43 101,44 103.5,44 OK4.4
N$36  (via drill 0.3)
  Top 0.152: v175,9 175,5 174,5 R25.2
  Bottom 0.152: v175,9 182.5,9 OK5.1
N$37
  Top 0.152: R16.2 194,39.5 195.5,39.5 RXLED.C
N$38
  Top 0.152: R17.2 193,16.5 195.5,16.5 LED13.C
N$39  (via drill 0.3)
  Top 0.152: v139.5,32.5 140.5,32.5 Q5.2 | v131.5,32.5 131.5,39 R26.P$1
  Bottom 0.152: v131.5,32.5 v139.5,32.5
N$40  (via drill 0.3)
  Top 0.152: v104,22 104,14.5 104.5,14 IC1.41 | v107,33 v107,26.5 | v111.5,33 111.5,38.5 S1.1 111.5,39 v111.5,42 | v133,42 133,46.5 RN1.2
  Bottom 0.152: v104,22 104,26.5 v107,26.5 | v111.5,33 v107,33 | v111.5,42 v133,42
N$41  (via drill 0.3)
  Top 0.152: v104.5,21.5 104.5,15 105,15 IC1.40 | v114.5,26.5 114.5,35.5 114,36 114,38.5 S1.2 114,39 v114,41.5 | v135,41.5 135,43 135.5,43.5 135.5,46.5 RN1.3
  Bottom 0.152: v104.5,21.5 111.5,21.5 113,23 113,26.5 v114.5,26.5 | v114,41.5 v135,41.5
N$42  (via drill 0.3)
  Top 0.152: v105,21 105,15.5 105.5,15.5 IC1.39 | v115,26 115,35.5 116.5,37 116.5,38.5 S1.3 116.5,39 v116.5,42.5 | v138,43.5 RN1.4
  Bottom 0.152: v105,21 115,21 115.5,21.5 116,21.5 116,22.5 115.5,22.5 114,24 114,26 v115,26 | v138,43.5 137.5,43 133.5,43 133,42.5 v116.5,42.5
N$43  (via drill 0.3)
  Top 0.152: v106,20.5 106,16 IC1.38 | v115.5,35 v115.5,26.5 | v119.5,35 119.5,38.5 S1.4 119.5,39 v119.5,43 | v140.5,44 140.5,46.5 RN1.5
  Bottom 0.152: v106,20.5 115,20.5 115.5,21 116,21 116.5,21.5 116.5,26.5 v115.5,26.5 | v119.5,35 v115.5,35 | v140.5,44 137.5,44 137,43.5 133.5,43.5 133,43 v119.5,43
N$44  (via drill 0.3)
  Top 0.152: v106.5,20 106.5,16.5 107,16.5 IC1.37 | v117,26 116,27 v116,35.5 | v122,35.5 122,38.5 S1.5 122,39 v122,43.5 | v143,44.5 143,46.5 RN1.6
  Bottom 0.152: v106.5,20 115,20 115.5,20.5 116,20.5 117,21.5 v117,26 | v122,35.5 v116,35.5 | v143,44.5 137.5,44.5 137,44 133.5,44 133,43.5 v122,43.5
N$45  (via drill 0.3)
  Top 0.152: v107,19.5 107,17 107.5,17 IC1.36 | v117.5,26.5 116.5,27.5 v116.5,36 | v124.5,36 124.5,38.5 S1.6 124.5,39 v124.5,44
  Bottom 0.152: v107,19.5 115,19.5 115.5,20 116,20 117.5,21.5 v117.5,26.5 | v124.5,36 v116.5,36 | v124.5,44 133,44 133.5,44.5 137,44.5 137.5,45 144,45 145.5,46.5 RN1.7
N$46  (via drill 0.3)
  Top 0.152: 134.5,29.5 134.5,30.5 136,32 Q5.1 | 134.5,29.5 v134.5,27.5 | R24.2 140.5,29.5 v140.5,27.5 v140.5,26.5 | 134.5,29.5 R23.2 | v172.5,15 172.5,12 OK5.3 | v161.5,22 v161.5,15.5
  Bottom 0.152: v134.5,27.5 v140.5,27.5 | v172.5,15 168.5,15 168,15.5 v161.5,15.5 | v161.5,22 161.5,26.5 v140.5,26.5
N$47  (via drill 0.3)
  Top 0.152: B5.- 147.5,27 v147.5,27.5 | 137.5,29.5 v137.5,27 | v131.5,27 131.5,29.5 R23.1 | Q5.3 138.5,33.5 137.5,32.5 137.5,29.5 | 137.5,29.5 R24.1
  Bottom 0.152: v147.5,27.5 141.5,27.5 141,27 v137.5,27 v131.5,27
N$48
  Top 1.016: 149.5,17.5 149.8,17.5 arc-90 U$7.P$4
  Top 1.93: B5.AC2 148.73,18.68 arc45 149.02,17.98 149.5,17.5
N$49  (via drill 0.3)
  Top 0.152: v150,27 B5.+ | v144,39 v144,27 | v171,17 171,10.5 172,9.5 OK5.4 | v162,21.5 v162,17
  Bottom 0.152: v144,27 149.5,27 | 149.5,27 v150,27 | R26.P$2 v144,39 | v162,17 v171,17 | v162,21.5 162,27 157,27 156.5,27.5 150,27.5 149.5,27
N$50  (via drill 0.3)
  Top 0.152: v144,13.5 144,11 R29.2
  Bottom 0.152: v144,13.5 141.5,13.5 OK6.1
N$51  (via drill 0.3)
  Top 0.152: v160,12.5 160,15.5 Q6.2
  Bottom 0.152: v160,12.5 159,11.5 R30.P$1
N$52  (via drill 0.3)
  Top 0.152: v165,22 v165,19 165,16 Q6.1 | 166.5,33 v166.5,26 | v160.5,34.5 160.5,33 R28.2 | 166.5,33 v166.5,34.5 | 166.5,33 R27.2
  Bottom 0.152: v165,22 166.5,23.5 v166.5,26 | v166.5,34.5 v160.5,34.5 | v165,19 146,19 145,18 141.5,18 140.5,17 133.5,17 133,16.5 131,16.5 OK6.3
N$53  (via drill 0.3)
  Top 0.152: B6.- 174.5,27 v174.5,27.5 | v163.5,27.5 163.5,33 R27.1 | v157.5,27.5 157.5,33 R28.1 | v162.5,22 Q6.3
  Bottom 0.152: v174.5,27.5 v163.5,27.5 162.5,27.5 | 162.5,27.5 v157.5,27.5 | 162.5,27.5 v162.5,22
N$54
  Top 1.016: U$8.P$4 176.75,17.38 arc90 176.5,17.13 176.5,17
  Top 1.93: B6.AC2 175.73,18.18 arc45 176.02,17.48 176.5,17
N$55  (via drill 0.3)
  Top 0.152: v178.5,25.5 178.5,27 B6.+ | v183,15.5 v183,25.5 | R30.P$2 169,11.5 v169,15.5 v169,19.5 | v133,17.5 v133,13.5
  Bottom 0.152: v183,25.5 v178.5,25.5 | v169,15.5 v183,15.5 | v133,13.5 131,13.5 OK6.4 | v133,17.5 140.5,17.5 141.5,18.5 145,18.5 146,19.5 v169,19.5
N$56  (via drill 0.3)
  other vias: 38,25
N$57  (via drill 0.3)
  other vias: 38,23
RESET  (via drill 0.3)
  Top 0.152: S2.P$1 180,4 | 180,4 179,4 R1.1 | v121,6 121,10 | IC1.13 111.5,5 111,5.5 v111,6 110.5,5.5 v110.5,5 | v180,1.5 180,4 | v142,10 v142,1.5 | 121,10 v122,10 | 121,10 C3.1
  Bottom 0.152: v111,6 v121,6 | v110.5,5 110,4.5 101.5,4.5 100.5,3.5 98,3.5 ICSP.5 | v142,1.5 v180,1.5 | v122,10 v142,10
RX  (via drill 0.3)
  Top 0.152: v116.5,7 116.5,8 116,8.5 IC1.20 115.5,9 115,9 v114,10 | v140,6 140,8 RX.1 | v25.5,14.5 25.5,23.25 arc90 25.25,23.5 24.75,23.5 arc90 24.5,23.25 24.5,20 23.5,20 U$3.1 | v69,9 v69,11.5 | v83.5,10 v83.5,8.5
  Bottom 0.152: v116.5,7 121.5,7 122,6.5 127.5,6.5 128,6 v140,6 | v25.5,14.5 32.5,14.5 33,15 39,15 40,14 57.5,14 58,13.5 59,13.5 61,11.5 v69,11.5 | v69,9 80.5,9 81,8.5 v83.5,8.5 | v114,10 v83.5,10
S$1  (via drill 0.3)
  other vias: 58,1.5
S$2  (via drill 0.3)
  other vias: 59,1.5
S$3  (via drill 0.3)
  other vias: 60,1.5
S$4  (via drill 0.3)
  other vias: 61,1.5
S$5  (via drill 0.3)
  other vias: 62,1.5
S$6  (via drill 0.3)
  other vias: 63,1.5
S$7  (via drill 0.3)
  other vias: 63,2.5
S$8  (via drill 0.3)
  other vias: 63,3.5
S$9  (via drill 0.3)
  other vias: 63,4.5
S$10  (via drill 0.3)
  other vias: 63,5.5
S$11  (via drill 0.3)
  other vias: 63,6.5
S$12  (via drill 0.3)
  other vias: 63,7.5
S$13  (via drill 0.3)
  other vias: 56.5,7.5
S$14  (via drill 0.3)
  other vias: 56.5,6.5
S$15  (via drill 0.3)
  other vias: 56.5,5.5
S$16  (via drill 0.3)
  other vias: 56.5,4.5
S$17  (via drill 0.3)
  other vias: 56.5,3.5
S$18  (via drill 0.3)
  other vias: 56.5,2.5
S$19  (via drill 0.3)
  other vias: 56.5,1.5
SCK  (via drill 0.3)
  Top 0.152: v107,1.5 107,4.5 107.5,5 IC1.9 | v95,1.5 95,3 ICSP.3
  Bottom 0.152: v95,1.5 v107,1.5
SCL  (via drill 0.3)
  Top 0.152: v116.5,4 116.5,6 116,6.5 116,7 115,7 IC1.18 | v147,7 147,11 R29.1
  Bottom 0.152: v116.5,4 131,4 131.5,4.5 140.5,4.5 141,5 145,5 v147,7
SS  (via drill 0.3)
  Top 0.152: v196.5,22 196.5,31 199,33.5 199,39.5 198,39.5 RXLED.A | v163,14 v163,21.5 | v123,8.5 v123,12 | v109,8 109,7.5 107.5,6 IC1.8
  Bottom 0.152: v196.5,22 169.5,22 169,21.5 v163,21.5 | v163,14 161,14 160.5,14.5 146,14.5 144.5,13 142,13 141,12 v123,12 | v123,8.5 116,8.5 115.5,8 v109,8
SUB_PW  (via drill 0.3)
  Top 0.61: IC4.3 56,14.55 56,16.5 55.5,17 v55,17 | v48,18 48,14.5 36,14.5 35.5,15 v35.5,25.5
  Bottom 0.61: v55,17 54,18 v48,18 | v35.5,25.5 33.5,25.5 33.5,23.5 33,23 29.5,23 29,23.5 29,25.06 JP3.2
TX  (via drill 0.3)
  Top 0.152: v117,4.5 v117,8 117,8.5 116.5,9 IC1.21 | v140,5 140,2.5 TX.1 | v24.5,14.5 24.5,16 23.5,16 U$3.4 | v68.5,8.5 v68.5,11 | v84.5,10.5 v84.5,8 | v109.5,7.5 v109.5,10.5
  Bottom 0.152: v117,4.5 131,4.5 131.5,5 v140,5 | v24.5,14.5 25,14 32.5,14 33,14.5 39,14.5 40,13.5 57.5,13.5 58,13 59,13 61,11 v68.5,11 | v68.5,8.5 80.5,8.5 81,8 v84.5,8 | v109.5,10.5 v84.5,10.5 | v109.5,7.5 115.5,7.5 116,8 v117,8
TXA  (via drill 0.3)
  Top 0.152: v196,21.5 196,31 197.5,32.5 197.5,35.5 TXLED.A | v135.5,9 v135.5,19 | v118,9 117,10 IC1.22
  Bottom 0.152: v196,21.5 169.5,21.5 169,21 146,21 145,20 141.5,20 140.5,19 v135.5,19 | v118,9 v135.5,9
VBUS  (via drill 0.3)
  Top 0.152: v191.5,15.5 191.5,13 JP1.1 | v187.5,15.5 187.5,16.5 F1.2 | v103,7.5 103,8.5 103.5,9 IC1.2 | IC1.7 106.5,6.5 v107.5,7.5 109,9 v109,12.5 | v31.5,15 31.5,25 JP3.1 | v69.5,9.5 v69.5,12.5 | v142.5,11.5 v142.5,15.5
  Bottom 0.152: v191.5,15.5 v187.5,15.5 184,15.5 183.5,15 173.5,15 173,14.5 168.5,14.5 168,15 161,15 160.5,15.5 v142.5,15.5 | v107.5,7.5 v103,7.5 102,8.5 92,8.5 91.5,9 81,9 80.5,9.5 v69.5,9.5 | v31.5,15 32.5,15 33,15.5 39,15.5 40,14.5 57.5,14.5 58,14 60.5,14 62,12.5 v69.5,12.5 | v142.5,11.5 142,11 122,11 121.5,11.5 116,11.5 115.5,12 114,12 113.5,12.5 v109,12.5
VIN  (via drill 0.3)
  Top 0.152: v67,10 C11.+ | v47,9.5 46.35,9.56
  Top 1.27: 36.5,12.5 35.5,12.5 34,14 v34,34 | v26.5,34 JP3.3
  Top 1.93: X1.2 35.69,11.28 arc-45 35.99,11.99 36.5,12.5 45,12.5 arc-45 45.71,12.21 D1.C 46.35,9.56 arc45 46.64,8.86 48,7.5 U$9.1
  Bottom 0.152: v67,10 51.5,10 51,9.5 v47,9.5
  Bottom 1.27: v34,34 v26.5,34
(copper drawn outside any net)
  shapes: Bottom area x7, Top area x13

### Text on the board
tPlace: B | A | GND | VCC | GND | VIN | USB | A | GND | GND | VCC | B
200bmp: CENTURION | Multi-Control System | LED AC PWM Board